# Altium project Item.PrjPCB
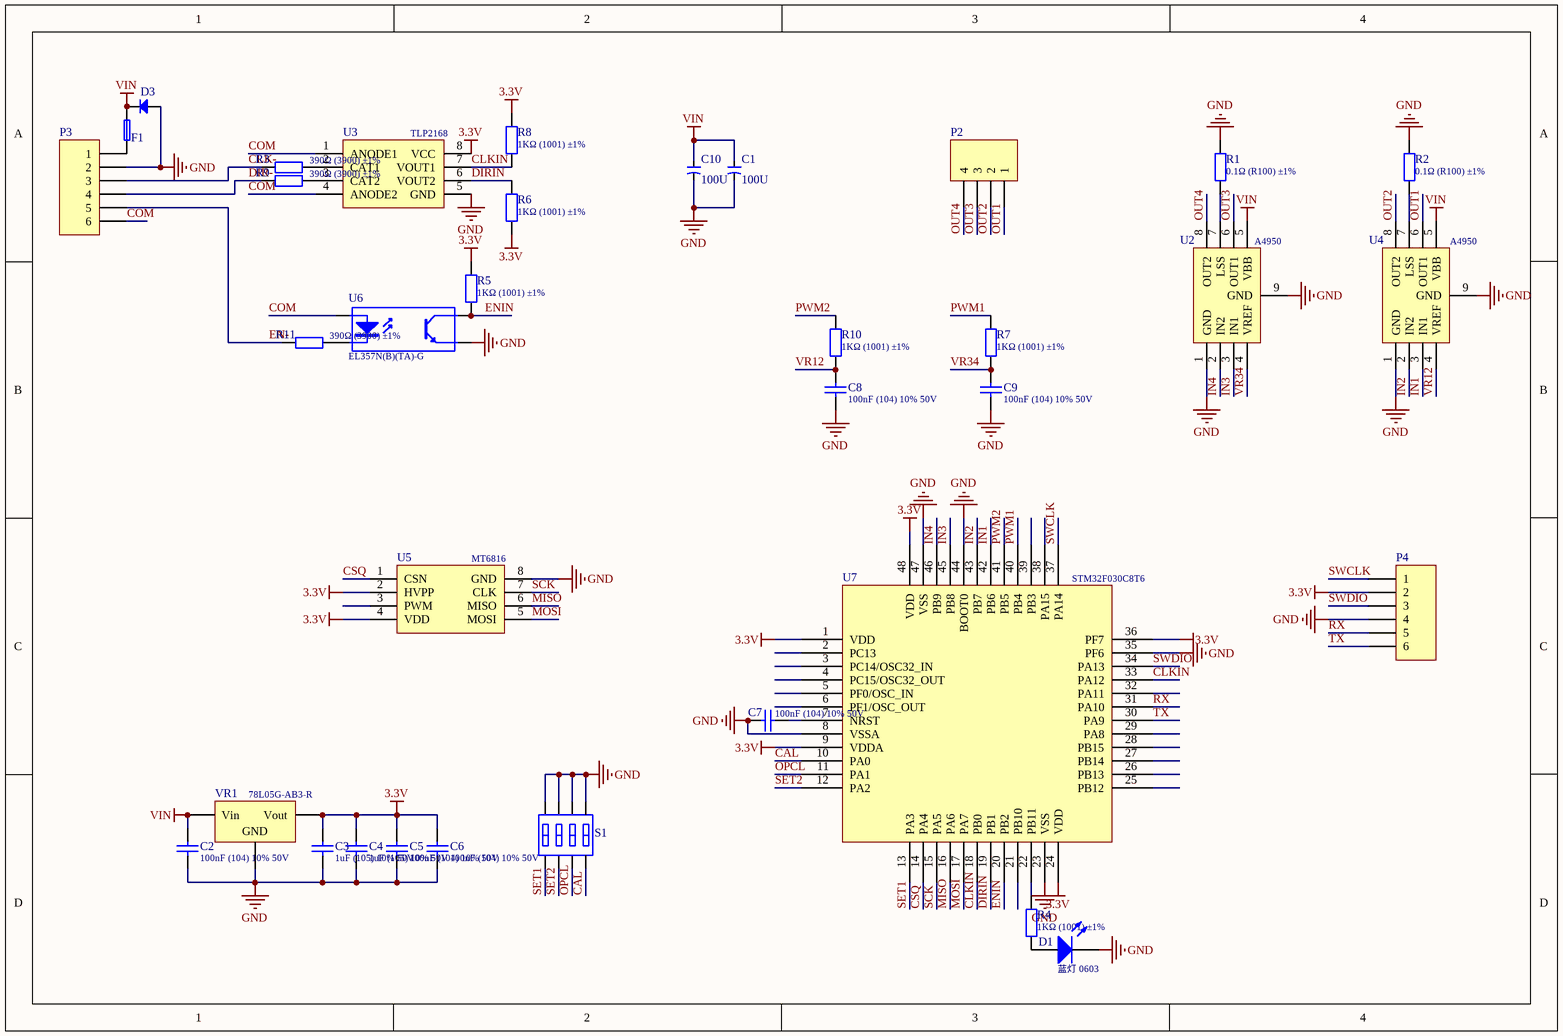
[diagram p0: Item.SchDoc]
1 sheet, 35 parts. Net scope: global (net labels, ports and power ports of the same name join across sheets).
Board file: Item.PcbDoc

## Sheet Item.SchDoc
size A4

### Parts
C1  value 100U  [CAP6377]  (hidden comment: CAP POL)
C2  100nF (104) 10% 50V  [0603_C]
C3  1uF (105) 10% 50V  [0603_C]
C4  1uF (105) 10% 50V  [0603_C]
C5  100nF (104) 10% 50V  [0603_C]
C6  100nF (104) 10% 50V  [0603_C]
C7  100nF (104) 10% 50V  [0603_C]
C8  100nF (104) 10% 50V  [0603_C]
C9  100nF (104) 10% 50V  [0603_C]
C10  value 100U  [CAP6377]  (hidden comment: CAP POL)
D1  蓝灯 0603  [0603_LED_S1]
D3  DIODE  [SOD-123]  (value not drawn)
F1  FUSE  [1206_R]  (value not drawn)
P2  HEADER4  [XH-4]  (value not drawn)
P3  HEADER6  [XH-6-S]  (value not drawn)
P4  HEADER6  [6P-1.27MM]  (value not drawn)
R1  0.1Ω (R100) ±1%  [1206_R]
R2  0.1Ω (R100) ±1%  [1206_R]
R3  390Ω (3900) ±1%  [0603_R]
R4  1KΩ (1001) ±1%  [0603_R]
R5  1KΩ (1001) ±1%  [0603_R]
R6  1KΩ (1001) ±1%  [0603_R]
R7  1KΩ (1001) ±1%  [0603_R]
R8  1KΩ (1001) ±1%  [0603_R]
R9  390Ω (3900) ±1%  [0603_R]
R10  1KΩ (1001) ±1%  [0603_R]
R11  390Ω (3900) ±1%  [0603_R]
S1  SWDIP-4  [SWSUR-4]  (value not drawn)
U2  A4950  [SOIC-8_A4950]
U3  TLP2168  [SO-8_3.9mm]
U4  A4950  [SOIC-8_A4950]
U5  MT6816  [PG-DSO-8S]
U6  EL357N(B)(TA)-G  [SOP-4_P2.54]
U7  STM32F030C8T6  [LQFP-48_7x7x05P]
VR1  78L05G-AB3-R  [SOT-89(SOT-89-3)]

### Nets
3.3V: C3.2 C4.2 C5.1 C6.1 P4.2 R5.2 R6.1 R8.2 U3.8(VCC) U5.2(HVPP) U5.4(VDD) U7.1(VDD) U7.9(VDDA) U7.24(VDD) U7.36(PF7) U7.48(VDD) VR1.1(Vout)
GND: C1.2 C2.2 C3.1 C4.1 C5.2 C6.2 C7.2 C8.1 C9.1 C10.2 D1.K D3.1(A) P3.2 P4.4 R1.1 R2.1 S1.2(B1) S1.4(B2) S1.6(B3) S1.8(B4) U2.1(GND) U2.9(GND) U3.5(GND) U4.1(GND) U4.9(GND) U5.8(GND) U6.3(E) U7.8(VSSA) U7.23(VSS) U7.35(PF6) U7.44(BOOT0) U7.47(VSS) VR1.2(GND)
VIN: C1.1 C2.1 C10.1 D3.2(K) F1.2 U2.5(VBB) U4.5(VBB) VR1.3(Vin)
CAL: S1.7(A4) U7.10(PA0)
CLK-: P3.3 R3.1
CLKIN: R8.1 U3.7(VOUT1) U7.18(PB0) U7.33(PA12)
COM: P3.6 U3.1(ANODE1) U3.4(ANODE2) U6.1(A)
CSQ: U5.1(CSN) U7.14(PA4)
DIR-: P3.4 R9.1
DIRIN: R6.2 U3.6(VOUT2) U7.19(PB1)
EN-: P3.5 R11.1
ENIN: R5.1 U6.4(C) U7.20(PB2)
IN1: U4.3(IN1) U7.42(PB6)
IN2: U4.2(IN2) U7.43(PB7)
IN3: U2.3(IN1) U7.45(PB8)
IN4: U2.2(IN2) U7.46(PB9)
MISO: U5.6(MISO) U7.16(PA6)
MOSI: U5.5(MOSI) U7.17(PA7)
OPCL: S1.5(A3) U7.11(PA1)
OUT1: P2.1 U4.6(OUT1)
OUT2: P2.2 U4.8(OUT2)
OUT3: P2.3 U2.6(OUT1)
OUT4: P2.4 U2.8(OUT2)
PWM1: R7.2 U7.40(PB4)
PWM2: R10.2 U7.41(PB5)
RX: P4.5 U7.31(PA10)
SCK: U5.7(CLK) U7.15(PA5)
SET1: S1.1(A1) U7.13(PA3)
SET2: S1.3(A2) U7.12(PA2)
SWCLK: P4.1 U7.37(PA14)
SWDIO: P4.3 U7.34(PA13)
TX: P4.6 U7.30(PA9)
VR12: C8.2 R10.1 U4.4(VREF)
VR34: C9.2 R7.1 U2.4(VREF)
NetC7_1: C7.1 U7.7(NRST)
NetD1_A: D1.A R4.1
NetF1_1: F1.1 P3.1
NetR1_2: R1.2 U2.7(LSS)
NetR2_2: R2.2 U4.7(LSS)
NetR3_2: R3.2 U3.2(CAT1)
NetR4_2: R4.2 U7.22(PB11)
NetR9_2: R9.2 U3.3(CAT2)
NetR11_2: R11.2 U6.2(K)

Not connected (* = marked no-connect by the designer): U5 3(PWM); U7 2(PC13) 3(PC14/OSC32_IN) 4(PC15/OSC32_OUT) 5(PF0/OSC_IN) 6(PF1/OSC_OUT) 21(PB10) 25(PB12) 26(PB13) 27(PB14) 28(PB15) 29(PA8) 32(PA11) 38(PA15) 39(PB3)

### Library data of the parts
C1 C10 = CAP POL: Polarized Capacitor (Axial); Published: 8-Jun-2000; LatestRevisionDate: 17-Jul-2002; LatestRevisionNote: Re-released for DXP Platform.; PackageReference: POLAR0.8; Publisher: Altium Limited; PackageDescription: Polarized Capacitor; 2 Leads
C2 C5-C9 = 0603 100nF (104) 10% 50V: 贴片电容; ComponentLink1Description: 供应商链接; ComponentLink1URL: http://www.szlcsc.com/product/details_15331.html; Package: 0603; Supplier: LC; SuppliersPartNumber: C14663
C3 C4 = 0603 1uF (105) 10% 50V: 贴片电容; ComponentLink1Description: 供应商链接; ComponentLink1URL: http://www.szlcsc.com/product/details_16531.html; Package: 0603; Supplier: LC; SuppliersPartNumber: C15849
D1 = 0603 蓝灯: 发光二极管; ComponentLink1Description: 供应商链接; ComponentLink1URL: http://www.szlcsc.com/product/details_73150.html; Package: 0603; Supplier: LC; SuppliersPartNumber: C72041
P2 = HEADER4: Header, 4-Pin; LatestRevisionDate: 17-Jul-2002; LatestRevisionNote: Re-released for DXP Platform.; Publisher: Altium Limited
P3 P4 = HEADER6: Header, 6-Pin; LatestRevisionDate: 17-Jul-2002; LatestRevisionNote: Re-released for DXP Platform.; Publisher: Altium Limited
R1 R2 = 1206 0.1Ω (R100) 1%: 贴片电阻; ComponentLink1Description: 供应商链接; ComponentLink1URL: http://www.szlcsc.com/product/details_26077.html; Package: 1206; Supplier: LC; SuppliersPartNumber: C25334
R3 R9 R11 = 0603 390Ω (3900) 1%: 贴片电阻; ComponentLink1Description: 供应商链接; ComponentLink1URL: http://www.szlcsc.com/product/details_23878.html; Package: 0603; Supplier: LC; SuppliersPartNumber: C23151
R4-R8 R10 = 0603 1KΩ (1001) 1%: 贴片电阻; ComponentLink1Description: 供应商链接; ComponentLink1URL: http://www.szlcsc.com/product/details_21904.html; Package: 0603; Supplier: LC; SuppliersPartNumber: C21190
S1 = SWDIP-4: DIP Switch, 4Position, SPST; Published: 24-Mar-1999; LatestRevisionDate: 17-Jul-2002; LatestRevisionNote: Re-released for DXP Platform.; PackageReference: DIP-6; Publisher: Altium Limited; Code_JEDEC: MO-001-AM
U2 U4 = A4950: Dual Full-Bridge  DMOS PWM Motor Driver
U3 = TLP2168: HIGH SPEED 10MBit/s LOGIC GATE  PHOTOCOUPLER
U5 = MT6816: GMR-Based Angle Sensor
U6 = EL357N(B)(TA)-G_[C6649]: 贴片光耦; ComponentLink1Description: 供应商链接; ComponentLink1URL: http://www.szlcsc.com/product/details_7114.html; Package: SOP-4_P2.54; Supplier: LC; SuppliersPartNumber: C6649
U7 = STM32F030C8T6: ARM; ComponentLink1Description: 供应商链接; ComponentLink1URL: http://www.szlcsc.com/product/details_24662.html; Package: LQFP-48_7x7x05P; Supplier: LC; SuppliersPartNumber: C23922
VR1 = SOT-89 78L05G-AB3-R: 低压差线性稳压(LDO); ComponentLink1Description: 供应商链接; ComponentLink1URL: http://www.szlcsc.com/product/details_72235.html; Package: SOT-89; Supplier: LC; SuppliersPartNumber: C71136
D3 = DIODE: Published: 8-Jun-2000; LatestRevisionDate: 17-Jul-2002; LatestRevisionNote: Re-released for DXP Platform.; PackageVersion: Sep-1996; PackageReference: SMC; Publisher: Altium Limited; PackageDescription: DO-214-AB/SMC; 2 C-Bend Leads; Body 7.9 x 5.9 mm, inc. leads (LxW); Code_JEDEC: DO-214-AB
F1 = FUSE: Published: 8-Jun-2000; LatestRevisionDate: 17-Jul-2002; LatestRevisionNote: Re-released for DXP Platform.; PackageReference: PIN-W2/E2.8; Publisher: Altium Limited; PackageDescription: Thru-Hole; 2 Leads